# EAGLE design GPRSshield V2 (EAGLE 7.2.0)
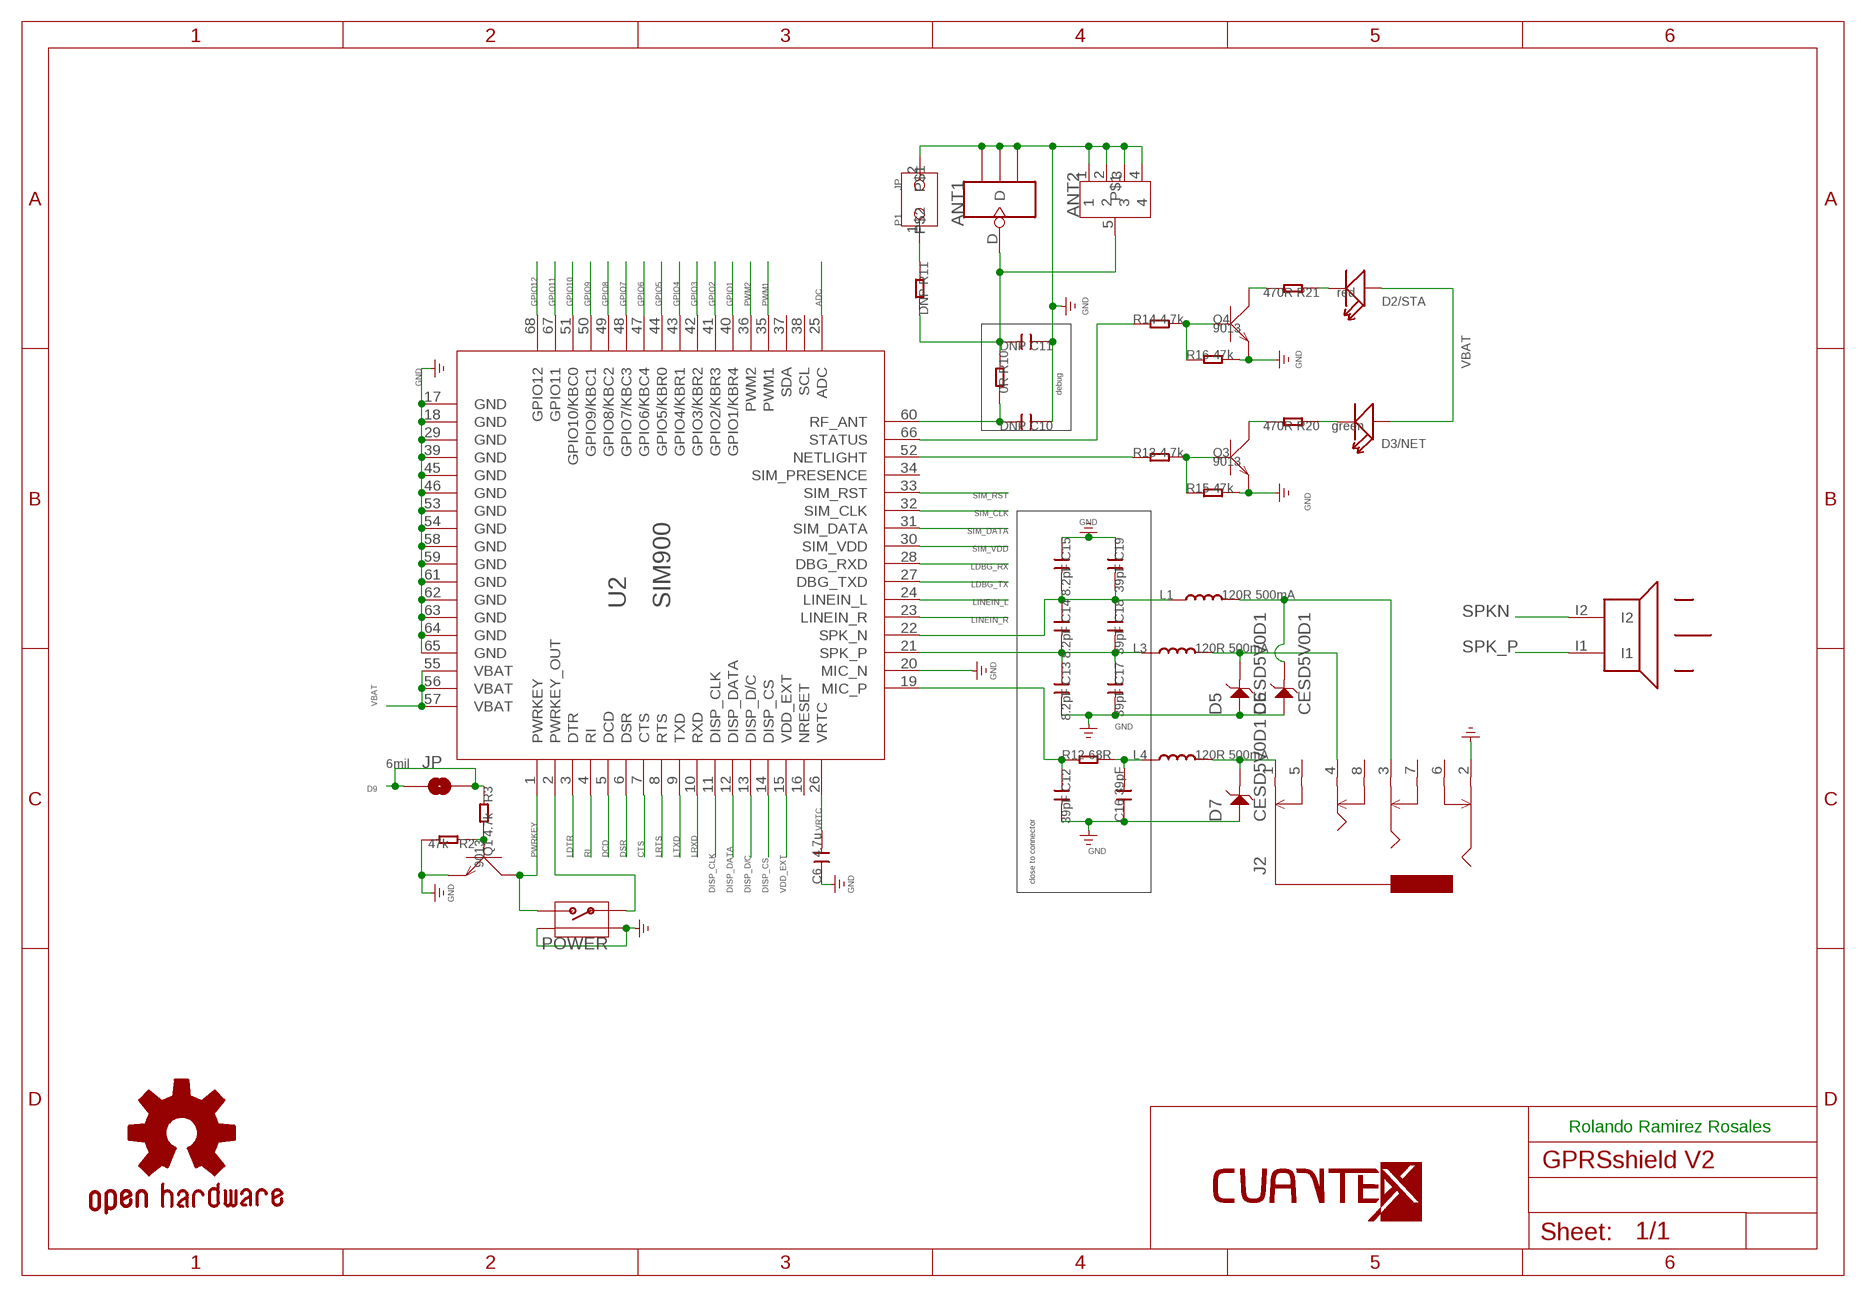
[diagram p0: schematic, sheet 1, part 1 of 2]
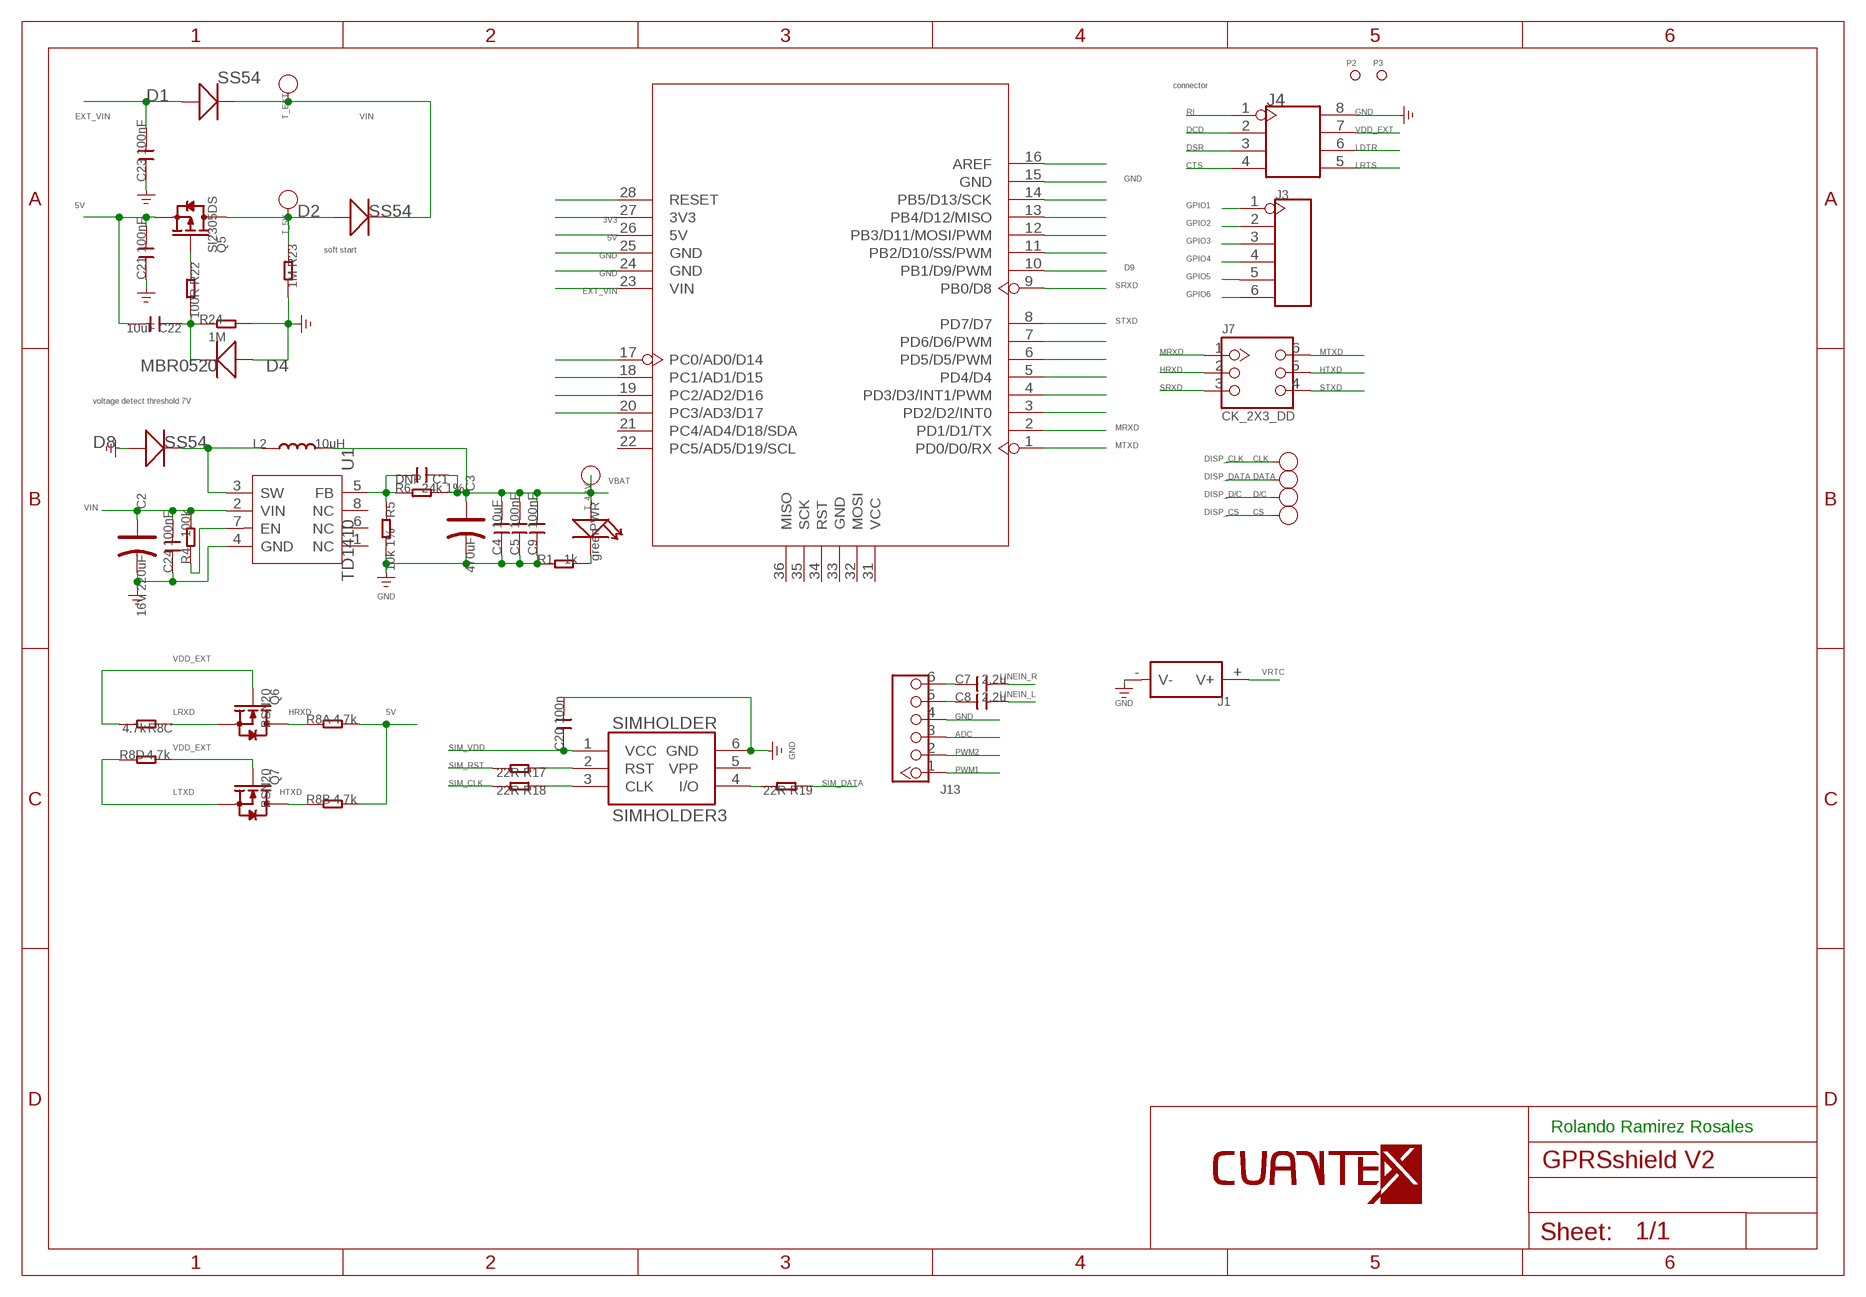
[diagram p1: schematic, sheet 1, part 2 of 2]

## Parts
ANT1  ANTENNA-U-FL  [4P-U-FL]
ANT2  ANTENNA-SMA-IPX  [SMA-TO-IPX]
C1  DNP  C-0603  [C0603]
C2  16V 220uF  CAP-ELECTRO-D  [ELECTRO-SMD-D-5.6MM]
C3  470uF  CAP-AVX-D  [AVX-D]
C4  10uF  C-0805  [C0805]
C5  100nF  C-0603  [C0603]
C6  4.7u  C-0805  [C0805]
C7  2.2u  C-0805  [C0805]
C8  2.2u  C-0805  [C0805]
C9  100nF  C-0603  [C0603]
C10  DNP  C-0603  [C0603]
C11  DNP  C-0603  [C0603]
C12  39pF  C-0603  [C0603]
C13  8.2pF  C-0603  [C0603]
C14  8.2pF  C-0603  [C0603]
C15  8.2pF  C-0603  [C0603]
C16  39pF  C-0603  [C0603]
C17  39pF  C-0603  [C0603]
C18  39pF  C-0603  [C0603]
C19  39pF  C-0603  [C0603]
C20  100n  C-0603  [C0603]
C21  100nF  C-0603  [C0603]
C22  10uF  C-0805  [C0805]
C23  100nF  C-0603  [C0603]
C24  100nF  C-0603  [C0603]
CLK  PAD-TEST-POINT-CIRCLE'4545'  [TP_4545]
CS  PAD-TEST-POINT-CIRCLE'4545'  [TP_4545]
D1  SS54  D'MBRS240LT3'  [SMB]
D2  SS54  D'MBRS240LT3'  [SMB]
D2/STA  red  LED'0603'  [LED-0603]
D3/NET  green  LED'0603'  [LED-0603]
D4  MBR0520  D'MBR0520LT1'  [SOD123-2.7X1.6]
D5  CESD5V0D1  D-ESD  [SOD123-2.7X1.6]
D6  CESD5V0D1  D-ESD  [SOD123-2.7X1.6]
D7  CESD5V0D1  D-ESD  [SOD123-2.7X1.6]
D8  SS54  D'MBRS240LT3'  [SMB]
D/C  PAD-TEST-POINT-CIRCLE'4545'  [TP_4545]
DATA  PAD-TEST-POINT-CIRCLE'4545'  [TP_4545]
GOLD_ORB_SM1  OSHWLOGO_GOLD_ORB_SM  [OSHW2]
J1  HOLDER-BAT  [SMD-CR1220-2]
J2  AUDIO-8P'PJ-3536-L6S'  [8P-3.5-SMD]
J3  HEADER-6P-65/35MIL  [6P-2.54-65/35MIL]
J4  HEADER-2X4P-2.54  [2X4P-2.54]
J7  CK_2X3_DD  [CK_2X3]
J13  HEADER_1X6  [CK_1X6]
JP  PAD-SOLDERJUMPERNC  [2P-SMD-3.3X2]
L1  120R 500mA  L'0603'  [L0603]
L2  10uH  L'0630'  [L0630]
L3  120R 500mA  L'0603'  [L0603]
L4  120R 500mA  L'0603'  [L0603]
P1  JP  [JP]
P2  PAD-MARK  [ROUND-MARK-1.0]
P3  PAD-MARK  [ROUND-MARK-1.0]
POWER  BUTTON-4P-REINFORCE'TS-118E'  [4P-SMD-7X3.5X3.5H]
PWR  green  007-LED0603  [D0603]
Q1  9013  TRANSISTOR-NPN-SOT23  [SOT23]
Q3  9013  TRANSISTOR-NPN-SOT23  [SOT23]
Q4  9013  TRANSISTOR-NPN-SOT23  [SOT23]
Q5  SI2305DS  MOSFET-P'SI2323CDS/SI2305DS<BR>'  [SOT23]
Q6  BSN20  MOSFET-N'SOT23'  [SOT23]
Q7  BSN20  MOSFET-N'SOT23'  [SOT23]
R1  1k  R-0603  [R0603]
R2  47k  R-0603  [R0603]
R3  4.7k  R-0603  [R0603]
R4  100k  R-0603  [R0603]
R5  10k 1%  R-0603  [R0603]
R6  24k 1%  R-0603  [R0603]
R8  4.7k  R-4R-1206  [1206-8-3.3X2.4]
R10  0R  R-0603  [R0603]
R11  DNP  R-0603  [R0603]
R12  68R  R-0603  [R0603]
R13  4.7k  R-0603  [R0603]
R14  4.7k  R-0603  [R0603]
R15  47k  R-0603  [R0603]
R16  47k  R-0603  [R0603]
R17  22R  R-0603  [R0603]
R18  22R  R-0603  [R0603]
R19  22R  R-0603  [R0603]
R20  470R  R-0603  [R0603]
R21  470R  R-0603  [R0603]
R22  100R  R-0603  [R0603]
R23  1M  R-0603  [R0603]
R24  1M  R-0603  [R0603]
SIMHOLDER  SIMHOLDER3  [SIMHOLDER3]
T_4.1V  PAD-TEST-POINT-CIRCLE'4545'  [TP_4545]
T_5V  PAD-TEST-POINT-CIRCLE'4545'  [TP_4545]
T_EXT  PAD-TEST-POINT-CIRCLE'4545'  [TP_4545]
U1  TD1410  [SOP8]
U2  SIM900  [SIM900]
U3  ARDUINO'W/O-SILK'  [ARDUINO-W/O-SILK]
U$4  SPEAKER_HETPRO  [SPK_SMD]
U$11  LOGO-TOP-10MM  [C-000]
U$23  LOGO-TOP-30MM  [C-1]

## Nets
3V3: U3.27(3V3)
5V: C21.2 C22.2 Q5.2(S) R8.7 R8.8 U3.26(5V)
ADC: J13.3 U2.25(ADC)
CTS: J4.4 U2.7(CTS)
D9: JP.1 JP.2 R3.1 U3.10(PB1/D9/PWM)
DCD: J4.2 U2.5(DCD)
DISP_CLK: CLK.T U2.11(DISP_CLK)
DISP_CS: CS.T U2.14(DISP_CS)
DISP_D/C: D/C.T U2.13(DISP_D/C)
DISP_DATA: DATA.T U2.12(DISP_DATA)
DSR: J4.3 U2.6(DSR)
EXT_VIN: C23.2 D1.+ U3.23(VIN)
GND: ANT1.GND1 ANT1.GND2 ANT1.GND3 ANT2.1 ANT2.2 ANT2.3 ANT2.4 C2.- C3.- C4.1 C5.1 C6.1 C9.1 C10.1 C11.1 C12.2 C13.2 C15.1 C16.1 C17.2 C19.1 C20.2 C21.1 C23.1 C24.1 D4.1(+) D5.1 D6.1 D7.1 D8.+ J1.-(V-) J2.2 J4.8 J13.4 P1.2 POWER.S1 POWER.S2 Q1.2(E) Q3.2(E) Q4.2(E) R1.1 R2.2 R5.2 R15.2 R16.2 R23.2 R24.2 SIMHOLDER.6(GND) U1.4(GND) U2.17(GND) U2.18(GND) U2.20(MIC_N) U2.29(GND) U2.39(GND) U2.45(GND) U2.46(GND) U2.53(GND) U2.54(GND) U2.58(GND) U2.59(GND) U2.61(GND) U2.62(GND) U2.63(GND) U2.64(GND) U2.65(GND) U3.15(GND) U3.24(GND) U3.25(GND)
GPIO1: J3.1 U2.40(GPIO1/KBR4)
GPIO2: J3.2 U2.41(GPIO2/KBR3)
GPIO3: J3.3 U2.42(GPIO3/KBR2)
GPIO4: J3.4 U2.43(GPIO4/KBR1)
GPIO5: J3.5 U2.44(GPIO5/KBR0)
GPIO6: J3.6 U2.47(GPIO6/KBC4)
GPIO7: U2.48(GPIO7/KBC3)
GPIO8: U2.49(GPIO8/KBC2)
GPIO9: U2.50(GPIO9/KBC1)
GPIO10: U2.51(GPIO10/KBC0)
GPIO11: U2.67(GPIO11)
GPIO12: U2.68(GPIO12)
HRXD: J7.2 Q6.3(D) R8.1
HTXD: J7.5 Q7.3(D) R8.2
LDBG_RX: U2.28(DBG_RXD)
LDBG_TX: U2.27(DBG_TXD)
LDTR: J4.6 U2.3(DTR)
LINEIN_L: C8.2 U2.24(LINEIN_L)
LINEIN_R: C7.2 U2.23(LINEIN_R)
LRTS: J4.5 U2.8(RTS)
LRXD: Q6.2(S) R8.3 U2.10(RXD)
LTXD: Q7.2(S) R8.4 U2.9(TXD)
MRXD: J7.1 U3.2(PD1/D1/TX)
MTXD: J7.6 U3.1(PD0/D0/RX)
N$1: C10.2 R10.2 U2.60(RF_ANT)
N$3: Q3.3(C) R20.2
N$4: R19.2 SIMHOLDER.4(I/O)
N$5: R18.1 SIMHOLDER.3(CLK)
N$6: R17.1 SIMHOLDER.2(RST)
N$7: D3/NET.- R20.1
N$8: Q3.1(B) R13.2 R15.1
N$9: PWR.- R1.2
N$10: R13.1 U2.52(NETLIGHT)
N$11: POWER.1 U2.2(PWRKEY_OUT)
N$12: R4.1 U1.7(EN)
N$13: C12.1 R12.1 U2.19(MIC_P)
N$15: C13.1 C14.2 C17.1 C18.2 L3.1 U2.21(SPK_P)
N$16: Q4.3(C) R21.2
N$17: D2/STA.- R21.1
N$18: Q4.1(B) R14.2 R16.1
N$19: C14.1 C15.2 C18.1 C19.2 L1.1 U2.22(SPK_N)
N$20: R14.1 U2.66(STATUS)
N$21: ANT1.D ANT2.5 C11.2 R10.1 R11.2
N$23: C7.1 J13.6
N$24: U3.3(PD2/D2/INT0)
N$25: U3.4(PD3/D3/INT1/PWM)
N$26: U3.5(PD4/D4)
N$27: U3.6(PD5/D5/PWM)
N$28: U3.7(PD6/D6/PWM)
N$29: C8.1 J13.5
N$30: C16.2 L4.1 R12.2
N$31: Q5.1(G) R22.1
N$32: U3.11(PB2/D10/SS/PWM)
N$33: U3.12(PB3/D11/MOSI/PWM)
N$34: U3.13(PB4/D12/MISO)
N$35: U3.14(PB5/D13/SCK)
N$36: Q1.1(B) R2.1 R3.2
N$37: U3.16(AREF)
N$39: C22.1 D4.2(-) R22.2 R24.1
N$41: U3.20(PC3/AD3/D17)
N$42: U3.19(PC2/AD2/D16)
N$43: U3.18(PC1/AD1/D15)
N$44: U3.17(PC0/AD0/D14)
N$45: D7.2 J2.1 L4.2
N$47: C1.2 R5.1 R6.1 U1.5(FB)
N$50: U3.28(RESET)
N$52: P1.1 R11.1
PU2: D8.- L2.1 U1.3(SW)
PWM1: J13.1 U2.35(PWM1)
PWM2: J13.2 U2.36(PWM2)
PWRKEY: POWER.2 Q1.3(C) U2.1(PWRKEY)
RI: J4.1 U2.4(RI)
SIM_CLK: R18.2 U2.32(SIM_CLK)
SIM_DATA: R19.1 U2.31(SIM_DATA)
SIM_RST: R17.2 U2.33(SIM_RST)
SIM_VDD: C20.1 SIMHOLDER.1(VCC) U2.30(SIM_VDD)
SPK_P: D5.2 J2.4 L3.2 U$4.I1
SPKN: D6.2 J2.3 L1.2 U$4.I2
SRXD: J7.3 U3.9(PB0/D8)
STXD: J7.4 U3.8(PD7/D7)
TRP1: D2.+ Q5.3(D) R23.1 T_5V.T
VBAT: C1.1 C3.+ C4.2 C5.2 C9.2 D2/STA.+ D3/NET.+ L2.2 PWR.+ R6.2 T_4.1V.T U2.55(VBAT) U2.56(VBAT) U2.57(VBAT)
VDD_EXT: J4.7 Q6.1(G) Q7.1(G) R8.5 R8.6 U2.15(VDD_EXT)
VIN: C2.+ C24.2 D1.- D2.- R4.2 T_EXT.T U1.2(VIN)
VRTC: C6.2 J1.+(V+) U2.26(VRTC)
Unconnected: J2.5 J2.6 J2.7 J2.8 SIMHOLDER.5(VPP) U1.1(NC) U1.6(NC) U1.8(NC) U2.16(NRESET) U2.34(SIM_PRESENCE) U2.37(SDA) U2.38(SCL) U3.21(PC4/AD4/D18/SDA) U3.22(PC5/AD5/D19/SCL) U3.31(VCC) U3.32(MOSI) U3.33(GND) U3.34(RST) U3.35(SCK) U3.36(MISO)

## Notes on the sheet
- connector
- soft start
- debug
- voltage detect threshold 7V
- 6mil
- close to connector
- Rolando Ramirez Rosales | Rolando Ramirez Rosales

## Library data of the parts
ANT1 = Connector:ANTENNA-U-FL
ANT2 = Elecrow_test:ANTENNA-SMA-IPX
C1 C4-C24 = Discrete:C*: Ceramic Capacitors
C2 C3 = Discrete:CAP*: Electrolytic Capacitors,Tantalum Capacitors and Super Capacitors
CLK CS D/C DATA T_4.1V T_5V T_EXT = Discrete:PAD-TEST-POINT-CIRCLE; PARTNO: DNP
D1 D2 D4 D8 = Discrete:D*
D2/STA D3/NET = Discrete:LED*
D5-D7 = template:D-ESD: Diodes for Protectiong against ESD
GOLD_ORB_SM1 = OPENHW:OSHWLOGO: These are Open-Source Hardware logos.
J1 = Connector:HOLDER-BAT: button cell holder
J2 = template:AUDIO-8P
J3 = Connector:HEADER-6P
J4 = Connector:HEADER-2X4P
J7 = CONNECTER:CK_2X3
J13 = CONNECTER:HEADER_1X6
JP = Discrete:PAD-SOLDERJUMPER: Solder Jumper Standard SMD solder jumper. Used to automate production. Two varients : Normally Open and Normally Closed are the same, but have different paste layers. NC will have a large amount of paste and should jumper during reflow.
L1-L4 = Discrete:L*
P1 = mySeeed:JP
P2 P3 = Discrete:PAD-MARK; PARTNO: DNP
POWER = Discrete:BUTTON-4P-REINFORCE: TS-1188E http://www.best-dz.com/?thread-374-2.html
PWR = Discrete:007-LED*
Q1 Q3 Q4 = Discrete:TRANSISTOR-NPN*: NPN audion
Q5 = Discrete:MOSFET-P
Q6 Q7 = Discrete:MOSFET-N: IRLL014: http://www.vishay.com/docs/91319/sihll014.pdf
R1-R6 R10-R24 = Discrete:R*
R8 = Discrete:R-4R*: Resistor Array
SIMHOLDER = SparkFun2:SIMHOLDER3
U1 = template:TD1410: 2A 380KHz 20V PWM Buck DC/DC Converter
U2 = ICs_v54:SIM900
U3 = moudle:ARDUINO
U$4 = Speaker_HeTPro:SPEAKER_HETPRO
U$11 = LOGOTIPOS:LOGO-TOP-10MM
U$23 = LOGOTIPOS:LOGO-TOP-30MM

## Net classes
0 default: clearance 0.152 mm

## Board
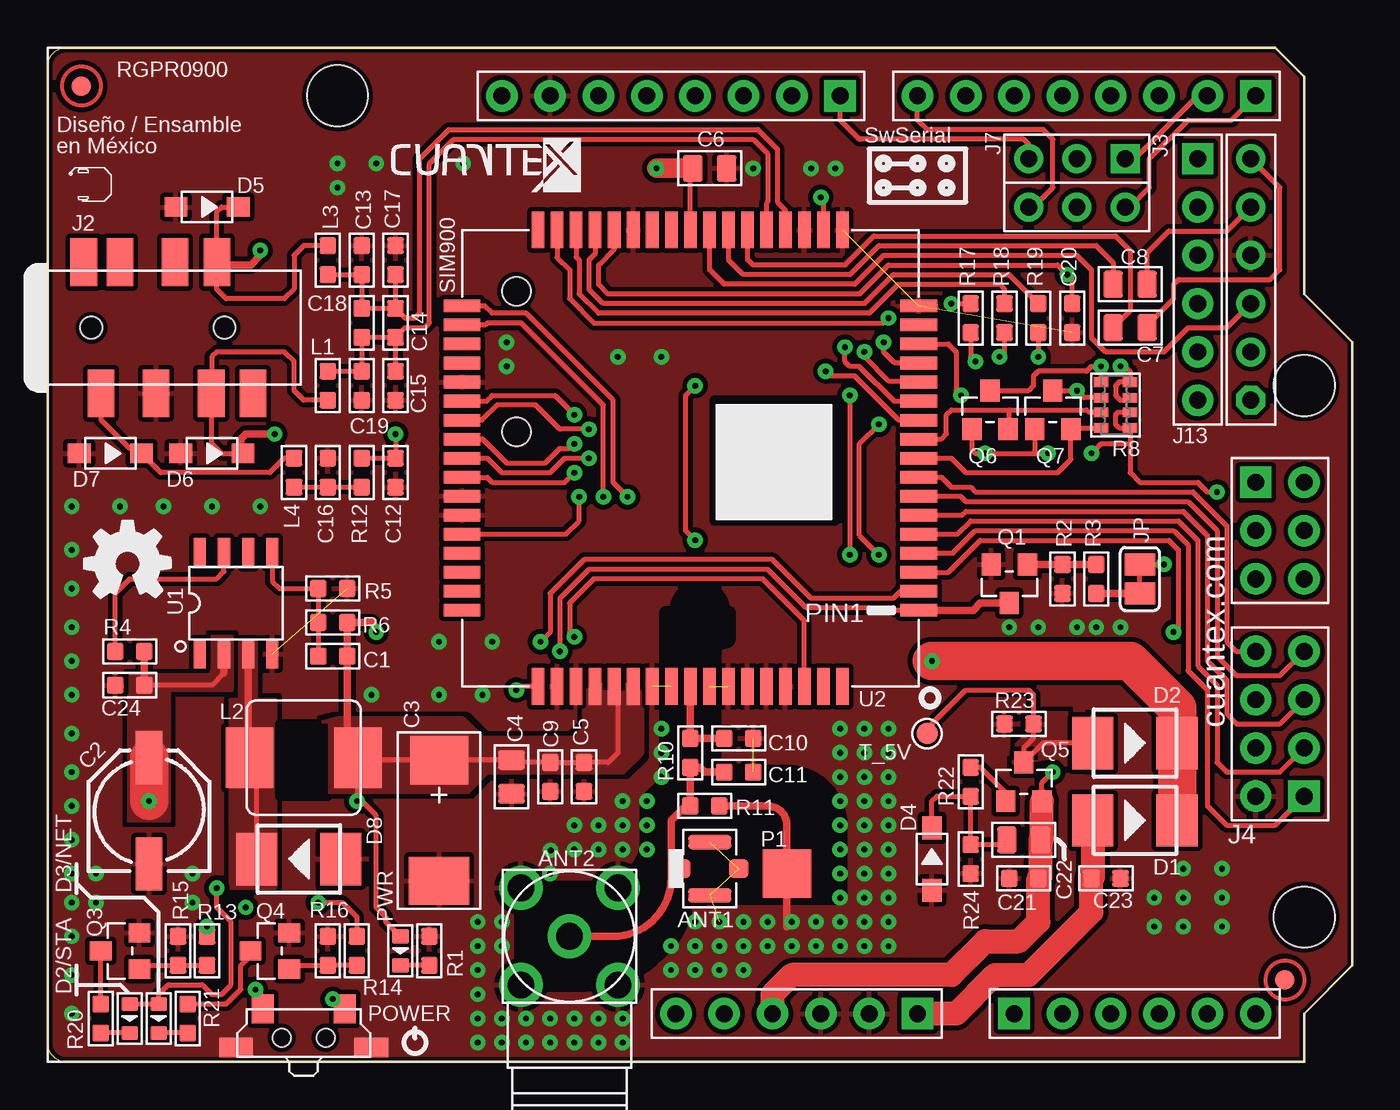
[diagram p2: board, top side]
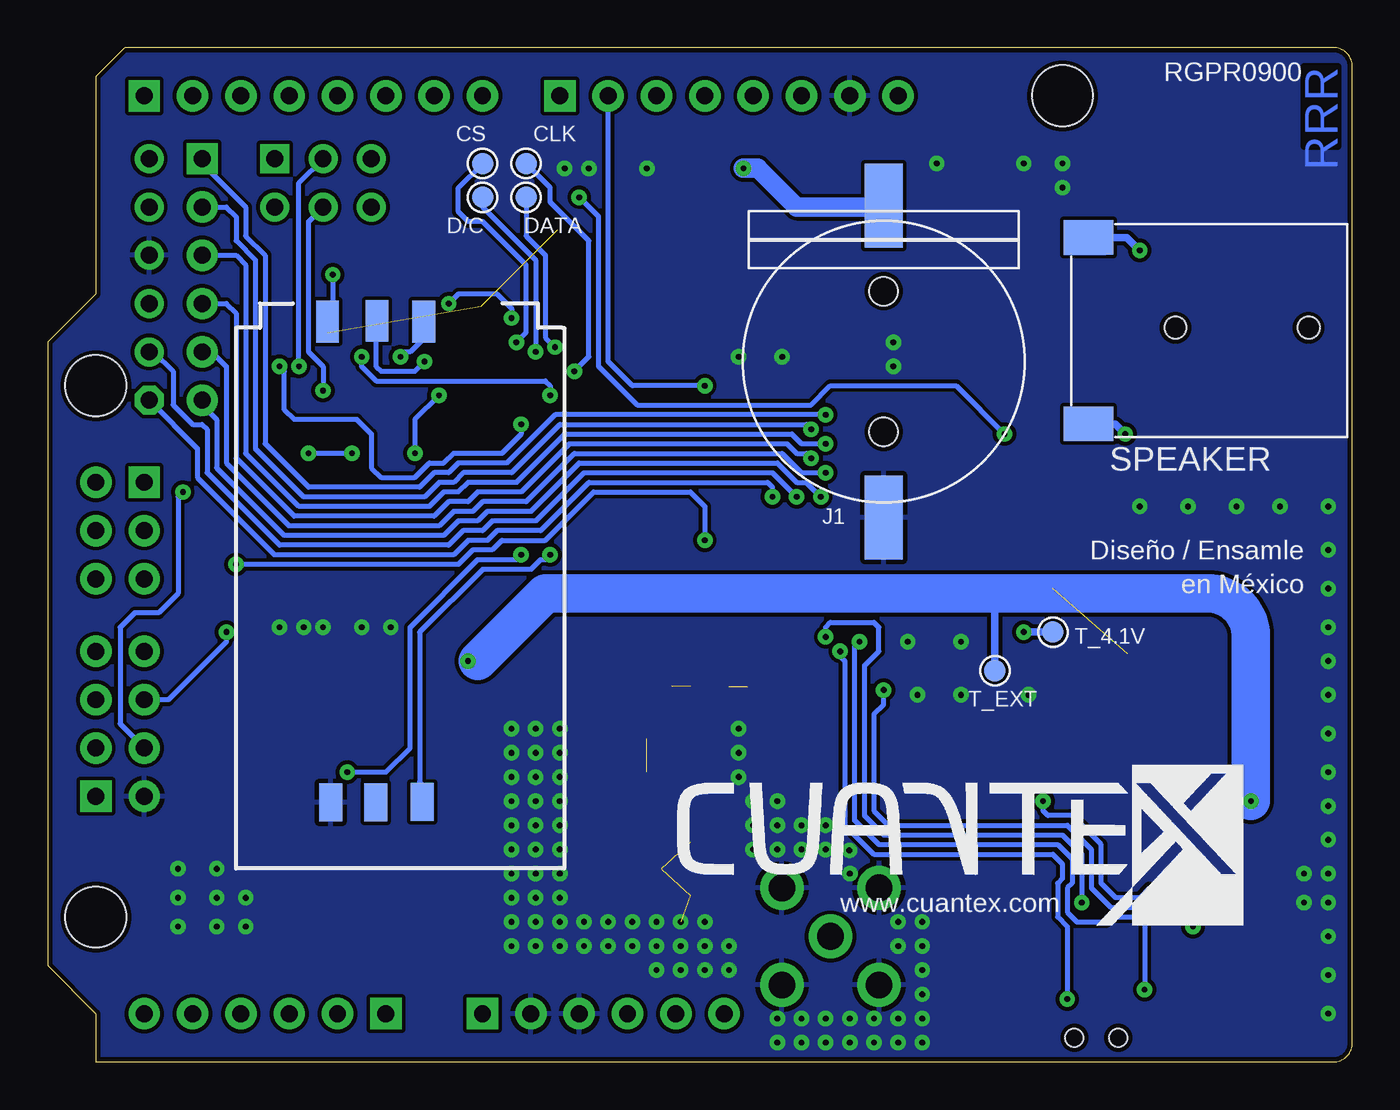
[diagram p3: board, bottom side, seen from below]

Size 68.58 x 53.34 mm. Coordinates in mm from the lower left corner, seen from the top.
Outline: 0,1.02 0,52.32 arc-90 1.02,53.34 64.52,53.34 66.04,51.82 66.04,40.39 68.58,37.85 68.58,5.08 66.04,2.54 66.04,0 1.02,0 arc-90 0,1.02
Copper layers (1*16): Top 0.035mm / dielectric 1.5mm / Bottom 0.035mm
Design rules "cuantex2layerdrc": minimum track width 8mil, minimum drill 0.3mm, track to track 8mil, track to pad 8mil, pad to pad 8mil, via to via 8mil, smd to smd 0mil, copper to edge 10mil, drill to drill 10mil, minimum pad ring 10mil, minimum via ring 10mil, stop-mask expansion 4mil, vias tented up to drill 0mil, thermal gap 10mil
tRestrict: area 24.9,4.1 to 41.7,23.6; area 35.1,28.4 to 41.4,34.8; area 27.2,19.6 to 27.4,20.1; area 29.2,19.6 to 29.5,20.1; area 30.1,19.5 to 30.3,20; area 36.2,19.5 to 36.4,20; area 37.2,19.5 to 37.4,20; area 38.2,19.5 to 38.4,20; area 21.5,29.1 to 22,29.4; area 12.2,14 to 14.7,17.8

### Footprints (pad centres in the part's own frame; a part is rotated, then mirrored left to right if it is on the bottom)
4P-U-FL = smd 1.016 x 1.016: D -1.524,0; GND3 1.524,0 | smd 2.286 x 0.762: GND1 0,1.397; GND2 0,-1.397
SMA-TO-IPX = drill 1.4 pad 2.3: 1 -2.55,2.55; 2 2.55,2.55; 3 2.55,-2.55; 4 -2.55,-2.55; 5 0,0
C0603 = smd 0.889 x 0.889: 1 -0.762,0; 2 0.762,0
ELECTRO-SMD-D-5.6MM = smd 2.794 x 1.397: + 2.794,0; - -2.794,0
AVX-D = smd 2.54 x 3.048: + -3.175,0 | smd 2.54 x 3.175: - 3.175,0
C0805 = smd 1.016 x 1.397: 1 -0.889,0; 2 0.889,0
TP_4545 = smd 1.143 x 1.143: T 0,0
SMB = smd 2.159 x 2.743: + -2.21,0; - 2.21,0
LED-0603 = smd 0.762 x 0.889: + -0.762,0; - 0.762,0
SOD123-2.7X1.6 = smd 1.2 x 1.02: 1 -1.635,0; 2 1.635,0
SMD-CR1220-2 = smd 2 x 4.4: + 0,-8.2; - 0,8.2 | hole 1.5: 0,3.7; 0,-3.7
8P-3.5-SMD = smd 1.4 x 2.5: 1 2.8,-3.45; 2 5.7,-3.45; 3 8.6,-3.45; 4 8.9,3.45; 5 1.9,3.45; 6 3.8,3.45; 7 6.7,3.45; 8 10.8,-3.45 | hole 1.149: 2.3,0; 9.3,0
6P-2.54-65/35MIL = drill 0.889 pad 1.651 square: 1 0,6.35 | drill 0.889 pad 1.651: 2 0,3.81; 3 0,1.27; 4 0,-1.27; 5 0,-3.81; 6 0,-6.35
2X4P-2.54 = drill 0.889 pad 1.651 square: 1 -1.27,3.81 | drill 0.889 pad 1.651: 2 -1.27,1.27; 3 -1.27,-1.27; 4 -1.27,-3.81; 5 1.27,-3.81; 6 1.27,-1.27; 7 1.27,1.27; 8 1.27,3.81
CK_2X3 = drill 0.889 pad 1.524 square: 1 -1.27,2.54 | drill 0.889 pad 1.524: 2 -1.27,0; 3 -1.27,-2.54; 4 1.27,-2.54; 5 1.27,0; 6 1.27,2.54
CK_1X6 = drill 0.889 pad 1.524 octagon: 1 0,6.35 | drill 0.889 pad 1.524: 2 0,3.81; 3 0,1.27; 4 0,-1.27; 5 0,-3.81; 6 0,-6.35
2P-SMD-3.3X2 = smd 1.168 x 1.6: 1 -0.762,0; 2 0.762,0
L0603 = smd 0.889 x 0.889: 1 -0.762,0; 2 0.762,0
L0630 = smd 2.5 x 3.2: 1 -2.85,0; 2 2.85,0
JP = smd 1.27 x 2.54: 1 -0.635,0; 2 0.635,0
ROUND-MARK-1.0 = smd 1.016 x 1.016: P$1 0,0
4P-SMD-7X3.5X3.5H = smd 1.143 x 1.524: 1 -2.159,1.524; 2 2.159,1.524 | smd 1.778 x 1.016: S1 -3.556,-0.508; S2 3.556,-0.508 | hole 0.95: -1.15,0; 1.15,0
D0603 = smd 0.762 x 0.889: + -0.762,0; - 0.762,0
SOT23 = smd 1.016 x 1.143: 1 -0.95,-1.016; 2 0.95,-1.016; 3 0,1.016
R0603 = smd 0.889 x 0.889: 1 -0.762,0; 2 0.762,0
1206-8-3.3X2.4 = smd 0.508 x 0.762: 1 -1.206,-0.762; 2 -0.381,-0.762; 3 0.381,-0.762; 4 1.206,-0.762; 5 1.206,0.762; 6 0.381,0.762; 7 -0.381,0.762; 8 -1.206,0.762
SIMHOLDER3 = smd 2.2 x 1.2: 1 0.95,4.81; 2 0.91,7.41; 3 0.95,9.86 | smd 2 x 1.2: 4 26.2,9.78; 5 26.22,7.34; 6 26.22,4.98
SOP8 = smd 0.635 x 1.524: 1 -1.905,-2.667; 2 -0.635,-2.667; 3 0.635,-2.667; 4 1.905,-2.667; 5 1.905,2.667; 6 0.635,2.667; 7 -0.635,2.667; 8 -1.905,2.667
SIM900 = smd 1.93 x 0.66: 1 -12,8; 2 -12,7; 3 -12,6; 4 -12,5; 5 -12,4; 6 -12,3; 7 -12,2; 8 -12,1; 9 -12,0; 10 -12,-1; 11 -12,-2; 12 -12,-3; 13 -12,-4; 14 -12,-5; 15 -12,-6; 16 -12,-7; 17 -12,-8; 35 12,-8; 36 12,-7; 37 12,-6; 38 12,-5; 39 12,-4; 40 12,-3; 41 12,-2; 42 12,-1; 43 12,0; 44 12,1; 45 12,2; 46 12,3; 47 12,4; 48 12,5; 49 12,6; 50 12,7; 51 12,8 | smd 0.66 x 1.93: 18 -8,-12; 19 -7,-12; 20 -6,-12; 21 -5,-12; 22 -4,-12; 23 -3,-12; 24 -2,-12; 25 -1,-12; 26 0,-12; 27 1,-12; 28 2,-12; 29 3,-12; 30 4,-12; 31 5,-12; 32 6,-12; 33 7,-12; 34 8,-12; 52 8,12; 53 7,12; 54 6,12; 55 5,12; 56 4,12; 57 3,12; 58 2,12; 59 1,12; 60 0,12; 61 -1,12; 62 -2,12; 63 -3,12; 64 -4,12; 65 -5,12; 66 -6,12; 67 -7,12; 68 -8,12
ARDUINO-W/O-SILK = drill 0.889 pad 1.651 square: 1 63.5,50.8; 9 41.656,50.8; 17 50.8,2.54; 23 45.72,2.54; 36 63.5,30.48 | drill 0.889 pad 1.651: 2 60.96,50.8; 3 58.42,50.8; 4 55.88,50.8; 5 53.34,50.8; 6 50.8,50.8; 7 48.26,50.8; 8 45.72,50.8; 10 39.116,50.8; 11 36.576,50.8; 12 34.036,50.8; 13 31.496,50.8; 14 28.956,50.8; 15 26.416,50.8; 16 23.876,50.8; 18 53.34,2.54; 19 55.88,2.54; 20 58.42,2.54; 21 60.96,2.54; 22 63.5,2.54; 24 43.18,2.54; 25 40.64,2.54; 26 38.1,2.54; 27 35.56,2.54; 28 33.02,2.54; 31 66.04,30.48; 32 66.04,27.94; 33 66.04,25.4; 34 63.5,25.4; 35 63.5,27.94 | hole 3.2: 15.24,50.8; 66.04,35.56; 66.04,7.62
SPK_SMD = smd 2.6 x 1.8: I1 -6,5; I2 -6,-4.8

### Placement (x,y rotation side)
ANT1  34.8,10.16 0 top
ANT2  27.43,6.6 0 top
C1  14.99,21.34 180 top
C2  5.33,13.21 90 top
C3  20.57,12.7 270 top
C4  24.38,14.99 90 top
C5  28.19,14.99 90 top
C6  34.8,46.99 180 top
C7  56.9,38.61 180 top
C8  56.9,40.89 180 top
C9  26.42,14.99 90 top
C10  36.32,17.02 180 top
C11  36.32,15.24 180 top
C12  18.29,30.99 270 top
C13  16.51,42.16 90 top
C14  18.29,38.86 90 top
C15  18.29,35.56 90 top
C16  14.73,30.99 270 top
C17  18.29,42.16 90 top
C18  16.51,38.86 90 top
C19  16.51,35.56 90 top
C20  53.85,39.12 270 top
C21  51.31,9.65 0 top
C22  51.31,11.68 0 top
C23  55.63,9.65 180 top
C24  4.32,19.81 0 top
CLK  43.43,47.24 0 bottom
CS  45.72,47.24 0 bottom
D1  57.15,12.7 0 top
D2  57.15,16.76 0 top
D2/STA  5.84,2.29 270 top
D3/NET  4.32,2.29 270 top
D4  46.48,10.67 90 top
D5  8.38,44.96 0 top
D6  8.64,32 0 top
D7  3.3,32 0 top
D8  13.21,10.67 180 top
D/C  45.72,45.47 0 bottom
DATA  43.43,45.47 0 bottom
GOLD_ORB_SM1  0.38,21.92 0 top
J1  24.64,36.83 180 bottom
J2  0,38.61 0 top
J3  60.45,41.15 0 top
J4  64.77,17.78 180 top
J7  54.1,46.23 270 top
J13  63.25,41.15 180 top
JP  57.4,25.4 270 top
L1  14.73,35.56 270 top
L2  13.46,16 0 top
L3  14.73,42.16 90 top
L4  12.95,30.99 90 top
P1  38.86,9.91 270 top
P2  65.02,4.32 0 top
P3  1.78,51.31 0 top
POWER  13.46,1.27 0 top
PWR  18.54,5.84 270 top
Q1  50.55,25.15 180 top
Q3  3.81,5.84 90 top
Q4  11.68,5.84 90 top
Q5  51.31,14.73 0 top
Q6  49.53,34.29 0 top
Q7  52.83,34.29 0 top
R1  20.07,5.84 270 top
R2  53.34,25.4 270 top
R3  55.12,25.4 90 top
R4  4.32,21.59 0 top
R5  14.99,24.89 0 top
R6  14.99,23.11 0 top
R8  56.13,34.54 270 top
R10  33.78,16.26 90 top
R11  34.54,13.46 180 top
R12  16.51,30.99 270 top
R13  8.38,5.84 270 top
R14  16.26,5.84 270 top
R15  6.86,5.84 90 top
R16  14.73,5.84 90 top
R17  48.51,39.12 90 top
R18  50.29,39.12 90 top
R19  52.07,39.12 270 top
R20  2.79,2.29 90 top
R21  7.37,2.29 90 top
R22  48.51,14.73 270 top
R23  51.05,17.78 180 top
R24  48.51,10.67 270 top
SIMHOLDER  58.67,39.88 270 bottom
T_4.1V  15.75,22.61 0 bottom
T_5V  46.23,17.27 0 top
T_EXT  18.8,20.57 0 bottom
U1  9.91,24.13 0 top
U2  33.78,31.75 180 top
U3  0,0 0 top
U$4  7.87,38.35 0 bottom
U$11  18.03,45.72 0 top
U$23  35.56,7.11 0 bottom

### Tracks (layer width: path | path; a pad name or v marks a point on that pad's centre or on a via)
5V  (via drill 0.3)
  Top 0.254: 52.26,11.74 C22.2 | 52.2,9.78 C21.2 | R8.7 56.77,34.8 56.39,34.8 56.13,35.05 56.13,35.56 56.33,35.75 R8.8 56.9,36.32 56.64,36.58 v56.39,36.58 | Q5.2 52.26,14.67 v52.83,15.24 | v43.69,33.53 42.67,32.51 42.67,27.69 v43.69,26.67
  Top 1.27: U3.26 38.1,3.56 39.12,4.57 47.5,4.57 49.28,6.35 51.05,6.35 52.07,7.37 C21.2 | 52.2,9.78 C22.2 | 52.26,11.74 Q5.2
  Bottom 0.254: v52.83,15.24 50.8,15.24 49.53,16.51 49.53,22.86 45.97,26.42 43.94,26.42 v43.69,26.67 | v43.69,33.53 43.69,33.02 44.7,32 47.24,32 47.75,31.5 48.51,31.5 49.28,30.73 51.05,30.73 51.56,31.24 51.56,33.02 52.32,33.78 55.63,33.78 56.13,34.29 56.13,36.32 v56.39,36.58
ADC
  Top 0.254: J13.3 61.98,38.61 59.94,38.61 58.67,37.34 55.63,37.34 54.86,38.1 54.86,41.66 54.1,42.42 43.94,42.42 42.42,40.89 35.56,40.89 34.8,41.66 34.8,43.73 U2.25
CTS
  Top 0.254: U2.7 47.97,29.75 48.26,29.46 59.94,29.46 61.47,27.94 61.47,21.34 62.48,20.32 64.77,20.32 J4.4
D9  (via drill 0.3)
  Top 0.254: v58.67,26.16 JP.1 JP.2 | v34.04,27.43 33.53,27.94 33.53,35.05 v34.04,35.56
  Top 0.406: JP.2 R3.1
  Bottom 0.254: v34.04,35.56 37.85,35.56 39.12,36.83 U3.10 | v58.67,26.16 46.99,26.16 46.23,26.92 45.21,26.92 44.7,27.43 42.42,27.43 39.88,29.97 34.8,29.97 34.04,29.21 v34.04,27.43
DCD
  Top 0.254: U2.5 47.82,27.75 48.51,28.45 59.44,28.45 60.45,27.43 60.45,20.83 61.47,19.81 61.47,15.75 61.98,15.24 64.77,15.24 J4.2
DISP_CLK  (via drill 0.3)
  Top 0.254: U2.11 44.74,33.75 42.42,36.07 41.15,36.07 v40.89,36.32
  Bottom 0.254: CLK.T 42.16,45.97 42.16,45.21 40.13,43.18 40.13,37.08 v40.89,36.32
DISP_CS  (via drill 0.3)
  Top 0.254: U2.14 44.53,36.75 43.94,37.34 v43.94,37.85
  Bottom 0.254: CS.T 46.99,45.97 46.99,44.7 46.48,44.2 45.72,44.2 43.43,41.91 43.43,38.35 v43.94,37.85
DISP_D/C  (via drill 0.3)
  Top 0.254: v42.93,37.34 42.93,37.08 44.2,35.81 45.72,35.81 U2.13
  Bottom 0.254: D/C.T 45.72,44.96 42.93,42.16 v42.93,37.34
DISP_DATA  (via drill 0.3)
  Top 0.254: U2.12 44.5,34.75 42.67,36.58 42.16,36.58 41.91,36.83 v41.91,37.59
  Bottom 0.254: DATA.T 43.43,43.43 42.42,42.42 42.42,38.1 v41.91,37.59
DSR
  Top 0.254: U2.6 48.05,28.75 48.26,28.96 59.69,28.96 60.96,27.69 60.96,21.08 61.98,20.07 61.98,18.29 62.48,17.78 64.77,17.78 J4.3
EXT_VIN
  Top 0.254: 54.94,9.73 C23.2
  Top 1.27: D1.+ 54.94,9.73 | U3.23 47.75,2.54 49.78,4.57 51.56,4.57 54.86,7.87 C23.2
GND  (via drill 0.3)  (9 unrouted)
  Top 0.406: P1.2 38.86,7.11
  other vias: 15.24,45.97 15.24,47.24 17.27,47.24 21.84,47.24 40.13,46.99 41.4,46.99 32.26,37.08 29.97,37.08 11.18,29.21 8.64,29.21 6.1,29.21 3.81,29.21 1.27,29.21 1.27,26.92 1.27,24.89 1.27,22.86 1.27,21.08 1.27,19.3 1.27,17.27 1.27,15.24 1.27,13.46 1.27,11.68 1.27,9.91 2.54,9.91 1.27,8.38 2.54,8.38 1.27,6.6 1.27,4.57 1.27,2.54 7.62,8.38 7.62,9.91 22.86,19.3 20.57,19.3 20.57,22.1 23.37,22.1 32.26,17.53 32.26,16.26 32.26,14.99 31.5,11.18 31.5,13.72 30.23,13.72 30.23,12.45 31.5,12.45 26.44,11.13 30.23,11.18 28.96,11.18 27.69,12.45 27.69,11.18 34.04,6.1 28.96,12.45 32.77,6.1 32.77,4.83 34.04,7.37 35.31,7.37 36.58,7.37 37.85,7.37 39.12,7.37 42.93,7.37 44.2,7.37 41.66,8.64 42.93,8.64 44.2,8.64 44.2,9.91 42.93,9.91 41.66,9.91 41.66,11.18 42.93,11.18 44.2,11.18 44.2,12.45 42.93,12.45 41.66,12.45 41.66,13.72 42.93,13.72 44.2,13.72 44.2,14.99 42.93,14.99 41.66,14.99 41.66,16.26 42.93,16.26 44.2,16.26 44.2,17.53 42.93,17.53 41.66,17.53 50.55,22.86 52.07,22.86 54.1,22.86 55.12,22.86 56.39,22.86 58.17,7.11 58.17,8.64 59.69,7.11 59.69,8.64 59.69,10.16 61.72,10.16 61.72,8.64 61.72,7.11 24.13,36.58 24.13,37.85 37.08,46.99 17.02,19.3 35.31,6.1 26.42,9.91 34.04,4.83 36.58,4.83 22.61,7.37 35.31,4.83 22.61,6.1 23.88,7.37 23.88,6.1 22.61,4.83 22.61,3.56 22.61,2.29 22.61,1.02 23.88,2.29 23.88,1.02 25.15,2.29 25.15,1.02 26.42,2.29 26.42,1.02 27.69,2.29 27.69,1.02 28.96,1.02 28.96,2.29 30.23,2.29 30.23,1.02 41.66,7.37 40.39,7.37 36.58,6.1 37.85,6.1 39.12,6.1 40.39,6.1 41.66,6.1 42.93,6.1 44.2,6.1
  pour Bottom: 66.04,0 66.04,2.54 68.58,5.08 68.58,37.85 66.04,40.39 66.04,51.82 64.52,53.34 0,53.34 0,0
  pour Top (isolate 0.254, rank 6): -1,54 69,54 69,-1 -1,-1
GPIO1  (via drill 0.3)
  Top 0.254: U2.40 23.07,34.75 23.37,35.05 26.67,35.05 v27.69,34.04
  Bottom 0.254: v27.69,34.04 41.91,34.04 44.45,31.5 46.99,31.5 47.5,30.99 48.26,30.99 49.02,30.23 54.86,30.23 57.15,32.51 57.15,42.42 58.17,43.43 58.17,44.96 60.45,47.24 J3.1
GPIO2  (via drill 0.3)
  Top 0.254: v28.45,33.27 26.92,33.27 25.65,34.54 23.62,34.54 22.83,33.75 U2.41
  Bottom 0.254: J3.2 59.18,44.96 58.67,44.45 58.67,43.18 57.66,42.16 57.66,32.26 55.12,29.72 48.77,29.72 48.01,30.48 47.24,30.48 46.74,30.99 44.2,30.99 41.66,33.53 28.7,33.53 v28.45,33.27
GPIO3  (via drill 0.3)
  Top 0.254: U2.42 21.8,32.77 22.86,32.77 24.13,31.5 26.16,31.5 26.92,32.26 27.43,32.26 v27.69,32.51
  Bottom 0.254: J3.3 58.67,42.42 58.17,41.91 58.17,32 55.37,29.21 48.51,29.21 47.75,29.97 46.99,29.97 46.48,30.48 43.94,30.48 41.4,33.02 29.46,33.02 28.96,32.51 v27.69,32.51
GPIO4  (via drill 0.3)
  Top 0.254: v28.45,31.75 27.18,31.75 26.42,30.99 23.88,30.99 23.11,31.75 U2.43
  Bottom 0.254: J3.4 59.18,39.88 58.67,39.37 58.67,31.75 55.63,28.7 48.26,28.7 47.5,29.46 46.48,29.46 45.97,29.97 43.69,29.97 41.15,32.51 29.72,32.51 29.21,32 28.7,32 v28.45,31.75
GPIO5  (via drill 0.3)
  Top 0.254: U2.44 21.8,30.73 23.11,30.73 23.37,30.48 27.18,30.48 v27.69,30.99
  Bottom 0.254: J3.5 59.94,37.34 59.18,36.58 59.18,31.5 55.88,28.19 48.01,28.19 47.24,28.96 46.23,28.96 45.72,29.46 43.43,29.46 40.89,32 29.97,32 28.96,30.99 v27.69,30.99
GPIO6  (via drill 0.3)
  Top 0.254: U2.47 27.24,27.75 27.94,28.45 v27.94,29.72
  Bottom 0.254: J3.6 60.45,34.54 59.69,33.78 59.69,31.24 56.13,27.69 47.75,27.69 46.99,28.45 45.97,28.45 45.47,28.96 43.18,28.96 40.64,31.5 30.23,31.5 29.21,30.48 28.7,30.48 v27.94,29.72
HRXD  (via drill 0.3)
  Top 0.254: Q6.3 51.56,35.31 51.82,35.56 51.82,36.07 52.07,36.32 54.61,36.32 54.86,36.58 v55.37,36.58 R8.1
  Bottom 0.254: v55.37,36.58 55.37,46.23 J7.2
HTXD  (via drill 0.3)
  Top 0.254: Q7.3 v54.1,35.31 54.48,34.92 R8.2
  Bottom 0.254: J7.5 54.86,44.2 54.86,37.34 54.1,36.58 v54.1,35.31
LDTR  (via drill 0.3)
  Top 0.254: U2.3 47.34,25.75 49.02,27.43 58.93,27.43 59.44,26.92 59.44,22.86 v59.18,22.61
  Bottom 0.254: v59.18,22.61 59.18,22.1 62.23,19.05 J4.6
LINEIN_L
  Top 0.254: U2.24 35.78,42.2 36.58,41.4 42.16,41.4 43.69,42.93 55.12,42.93 56.01,42.04 C8.2
LINEIN_R
  Top 0.254: U2.23 36.78,42.21 37.08,41.91 41.91,41.91 43.43,43.43 56.13,43.43 56.9,42.67 56.9,39.5 C7.2
LRTS
  Top 0.254: U2.8 46.97,30.75 47.5,30.23 48.51,30.23 48.77,29.97 60.2,29.97 61.98,28.19 61.98,22.1 62.48,21.59 J4.5
LRXD
  Top 0.254: U2.10 45.8,32.77 46.99,32.77 47.24,33.02 47.24,34.04 47.5,34.29 50.55,34.29 | 50.55,34.29 54.61,34.29 54.74,34.16 R8.3 | Q6.2 50.55,33.34 50.55,34.29
LTXD
  Top 0.254: R8.4 53.85,33.34 Q7.2 53.78,31.68 53.09,30.99 48.26,30.99 47.5,31.75 U2.9
MRXD
  Top 0.254: J7.1 57.15,47.5 60.45,50.8 U3.2
MTXD
  Top 0.254: J7.6 56.9,44.96 57.91,45.97 57.91,47.5 59.94,49.53 62.23,49.53 U3.1
N$1
  Top 0.406: U2.60 R10.2 C10.2
N$3
  Top 0.254: R20.2 Q3.3
N$4  (via drill 0.3)
  Top 0.254: R19.2 v52.07,37.08 | v42.16,35.05 v42.16,26.67
  Bottom 0.254: SIMHOLDER.4 48.77,13.8 48.77,14.48 49.02,14.73 49.02,22.61 45.72,25.91 43.18,25.91 42.67,26.42 42.42,26.42 v42.16,26.67 | v42.16,35.05 42.16,35.56 42.42,35.81 51.31,35.81 52.07,36.58 v52.07,37.08
N$5  (via drill 0.3)
  Top 0.254: R18.1 50.29,37.34 v50.04,37.08
  Bottom 0.254: SIMHOLDER.3 48.77,38.88 48.77,38.1 49.53,37.34 49.78,37.34 v50.04,37.08
N$6  (via drill 0.3)
  Top 0.254: R17.1 48.51,37.08 v48.77,36.83
  Bottom 0.254: SIMHOLDER.2 51.31,38.92 51.31,36.58 51.05,36.32 49.28,36.32 v48.77,36.83
N$7
  Top 0.254: D3/NET.- R20.1
N$8
  Top 0.254: Q3.1 5.01,5.08 R15.1 R13.2
N$9
  Top 0.254: R1.2 PWR.-
N$10  (via drill 0.3)
  Top 0.254: U2.52 24.83,19.75 v24.64,19.56 | R13.1 v8.38,7.11
  Bottom 0.254: v24.64,19.56 24.64,18.8 25.15,18.29 25.15,13.21 24.38,12.45 14.99,12.45 13.72,11.18 13.72,9.14 12.7,8.13 v10.41,8.13 9.4,8.13 v8.38,7.11
N$11  (via drill 0.3)
  Top 0.254: U2.2 44.82,24.75 44.45,24.38 40.13,24.38 38.1,26.42 28.19,26.42 26.42,24.64 26.42,22.61 v25.91,22.1 | v10.92,3.81 11.3,3.43 POWER.1
  Bottom 0.254: v25.91,22.1 26.16,21.84 26.16,12.7 24.89,11.43 15.49,11.43 14.73,10.67 14.73,9.4 14.99,9.14 14.99,7.87 14.48,7.37 12.95,7.37 12.7,7.62 11.18,7.62 10.92,7.37 v10.92,3.81
N$12
  Top 0.254: R4.1 3.56,24.64 4.32,25.4 8.89,25.4 9.27,25.78 U1.7
N$13  (via drill 0.3)
  Top 0.254: R12.1 C12.1 v18.29,33.02 | U2.19 40.78,45.32 v40.64,45.47
  Bottom 0.254: v18.29,33.02 20.83,35.56 27.43,35.56 28.45,34.54 37.59,34.54 39.62,36.58 39.62,44.45 v40.64,45.47
N$15
  Top 0.254: L3.1 C13.1 C18.2 C14.2 | C14.2 18.8,39.12 19.3,39.12 19.56,39.37 19.56,47.5 21.08,49.02 37.34,49.02 38.35,48.01 38.35,45.21 38.78,44.78 U2.21 | C14.2 C17.1
N$16
  Top 0.254: R21.2 9.4,3.05 10.16,3.81 10.16,5.08 10.67,5.59 Q4.3
N$17
  Top 0.254: R21.1 D2/STA.-
N$18
  Top 0.254: R14.2 R16.1 12.89,5.08 Q4.1
N$19
  Top 0.254: L1.1 C19.2 C18.1 C14.1 | C15.2 C14.1 | C14.1 18.8,38.61 19.81,38.61 20.07,38.86 20.07,47.24 21.34,48.51 37.08,48.51 37.85,47.75 37.85,45.21 37.78,45.15 U2.22
N$20  (via drill 0.3)
  Top 0.254: U2.66 39.78,23.21 37.59,25.4 28.7,25.4 27.43,24.13 27.43,22.61 v27.69,22.35 | v14.22,8.38 15.49,8.38 16.26,7.62 R14.1
  Bottom 0.254: v27.69,22.35 27.69,22.86 27.43,23.11 25.15,23.11 24.89,22.86 24.89,21.59 25.65,20.83 25.65,12.95 24.64,11.94 15.24,11.94 14.22,10.92 v14.22,8.38
N$21
  Top 0.406: C11.2 34.54,15.24 34.29,15.49 R10.1 R11.2 33.53,13.46 32.77,12.7 32.77,10.67 32.89,10.54 | ANT1.D 32.89,10.54 | ANT2.5 29.72,6.6 arc90 32.77,9.65 32.77,10.41 arc-90 32.89,10.54
N$23
  Top 0.254: C7.1 57.78,38.73 59.18,40.13 59.18,40.89 59.44,41.15 64.26,41.15 64.77,41.66 64.77,45.97 J13.6
N$29
  Top 0.254: C8.1 57.78,42.55 58.93,43.69 61.98,43.69 J13.5
N$30
  Top 0.254: L4.1 C16.2 R12.2
N$31
  Top 0.254: Q5.1 50.36,14.16 49.02,15.49 R22.1
N$36
  Top 0.406: R3.2 R2.1 Q1.1
N$39
  Top 0.254: C22.1 50.16,11.43 R24.1 R22.2 46.74,13.97 46.48,13.72 D4.2
N$45
  Top 0.254: J2.1 2.8,33.78 4.32,32.26 4.68,32.26 D7.2 5.95,30.99 11.68,30.99 12.45,31.75 L4.2
N$47
  Top 0.254: U1.5 11.81,25.27 12.19,24.89 R5.1 R6.1 C1.2
N$52
  Top 0.406: R11.1 37.85,13.46 arc-90 38.86,12.45 P1.1
PU2
  Top 0.254: D8.- 11,15.62 L2.1 10.54,16.07
  Top 0.406: 10.54,16.07 U1.3
  pour Top (isolate 0.254, no thermals): 9.65,9.14 9.65,19.05 10.16,19.05 10.16,22.1 10.92,22.1 10.92,19.05 11.68,19.05 11.94,19.05 11.94,9.14
PWM1  (via drill 0.3)
  Top 0.254: U2.35 22.99,39.75 23.37,39.37 25.15,39.37 29.72,34.8 29.72,30.48 v30.48,29.72
  Bottom 0.254: J13.1 60.71,32.26 60.71,30.73 56.64,26.67 47.24,26.67 46.48,27.43 45.47,27.43 44.96,27.94 42.67,27.94 40.13,30.48 30.73,30.48 30.48,30.23 v30.48,29.72
PWM2  (via drill 0.3)
  Top 0.254: v29.21,29.72 29.21,34.54 24.89,38.86 23.11,38.86 23,38.75 U2.36
  Bottom 0.254: J13.2 62.99,37.34 61.98,36.32 61.98,34.54 60.96,33.53 60.45,33.53 60.2,33.27 60.2,30.99 56.39,27.18 47.5,27.18 46.74,27.94 45.72,27.94 45.21,28.45 42.93,28.45 40.39,30.99 30.48,30.99 v29.21,29.72
PWRKEY  (via drill 0.3)
  Top 0.254: v26.92,21.59 26.92,24.38 28.45,25.91 37.85,25.91 39.88,23.88 44.45,23.88 44.58,23.75 U2.1 | v14.99,3.3 15.49,2.79 POWER.2
  Top 0.406: U2.1 48.64,23.75 49.02,24.13 Q1.3
  Bottom 0.254: v26.92,21.59 26.92,21.34 26.67,21.08 26.67,12.45 25.15,10.92 15.75,10.92 15.24,10.41 15.24,9.65 15.49,9.4 15.49,7.62 14.99,7.11 v14.99,3.3
RI
  Top 0.254: U2.4 47.58,26.75 48.77,27.94 59.18,27.94 59.94,27.18 59.94,20.57 60.96,19.56 60.96,13.46 61.98,12.45 64.52,12.45 J4.1
SIM_CLK
  Top 0.254: U2.32 27.78,42.32 27.94,42.16 27.94,40.39 28.96,39.37 43.18,39.37 44.7,40.89 50.04,40.89 50.29,40.64 R18.2
SIM_DATA
  Top 0.254: U2.31 28.78,42.5 28.45,42.16 28.45,40.64 29.21,39.88 42.93,39.88 44.45,41.4 50.55,41.4 R19.1
SIM_RST  (via drill 0.3)
  Top 0.254: U2.33 26.78,42.31 27.43,41.66 27.43,40.13 28.7,38.86 43.94,38.86 v44.2,39.12 | v47.5,39.88 R17.2
  Bottom 0.254: v47.5,39.88 46.99,40.39 44.96,40.39 44.2,39.62 v44.2,39.12
SIM_VDD  (via drill 0.3)
  Top 0.254: U2.30 29.78,42.74 28.96,41.91 28.96,40.89 29.46,40.39 42.67,40.39 44.2,41.91 53.09,41.91 v53.59,41.4 53.85,41.15 C20.1 53.85,40.64
  Bottom 0.254: v53.59,41.4 53.59,39.2 SIMHOLDER.1
SPK_P  (via drill 0.3)
  Top 0.254: D5.2 9.14,44.96 8.9,44.71 J2.4 8.89,42.05 8.89,40.64 9.4,40.13 12.45,40.13 12.95,40.64 12.95,42.42 13.46,42.93 L3.2
  Top 0.406: v11.18,42.67 11.18,42.42 10.67,41.91 9.05,41.91 J2.4
  Bottom 0.406: U$4.I1 11.86,43.35 v11.18,42.67
SPKN  (via drill 0.3)
  Top 0.254: D6.2 9.14,32 8.6,32.55 J2.3 8.64,35.19 8.64,37.08 8.89,37.34 12.45,37.34 12.95,36.83 12.95,35.31 13.46,34.8 L1.2
  Top 0.406: v11.94,33.02 10.41,33.02 10.16,32.77 10.16,32.12 D6.2
  Bottom 0.406: U$4.I2 12.47,33.55 v11.94,33.02
SRXD
  Top 0.254: J7.3 51.56,48.26 51.31,48.51 42.67,48.51 41.66,49.53 U3.9
STXD
  Top 0.254: J7.4 51.82,44.96 52.83,45.97 52.83,48.51 52.32,49.02 46.23,49.02 45.72,49.53 U3.8
TRP1
  Top 0.254: D2.+ 52.32,16.76 Q5.3 51.31,16.51 51.82,17.02 R23.1 51.82,19.3 51.56,19.56 48.26,19.56 46.23,17.53 T_5V.T
  pour Top (isolate 0.254): 50.8,15.75 52.58,16 53.09,16 53.59,15.49 55.12,15.49 55.12,17.78 54.61,18.29 51.82,18.29 51.56,18.03 51.56,17.27 50.8,16.51
VBAT  (via drill 0.3)
  Top 0.254: L2.2 16.44,15.88 C3.+ C4.2 24.51,15.75 C9.2 C5.2 29.46,15.75 29.97,16.26 29.97,19.75 U2.56 | 15.75,16.57 L2.2 | D3/NET.+ D2/STA.+ 5.84,3.56 6.35,4.06 8.13,4.06 8.64,3.56 9.14,3.56 9.65,4.06 9.65,7.37 8.89,8.13 v8.89,9.14 | L2.2 16.31,13.77 v16.26,13.72 16.51,13.72 17.27,12.95 17.27,8.13 17.78,7.62 17.78,7.37 PWR.+
  Top 0.406: 15.75,16.57 C1.1 R6.2 17.02,23.11 17.27,22.86 v17.27,22.61
  Bottom 0.254: v8.89,9.14 10.67,9.14 11.18,8.64 12.45,8.64 13.21,9.4 13.21,11.43 14.73,12.95 16,12.95 16.26,13.21 v16.26,13.72
  Bottom 0.406: T_4.1V.T v17.27,22.61
  pour Top (no thermals): 14.22,14.22 22.1,14.22 23.11,15.24 30.23,15.24 31.24,16.26 31.24,19.3 30.73,19.81 28.7,19.81 28.19,19.3 28.19,17.53 27.69,17.02 22.86,17.02 21.84,18.03 15.24,18.03 14.22,17.78
VDD_EXT  (via drill 0.3)
  Top 0.254: R8.6 56.26,34.16 56.13,34.04 56.13,33.53 56.33,33.34 R8.5 56.9,32.51 | Q6.1 48.58,32.19 48.77,32 v49.28,32 51.82,32 | U2.15 47.34,37.75 47.75,37.34 47.75,35.31 v48.01,35.05 | v54.86,32 55.37,32.51 56.9,32.51 | 51.82,32 v52.58,32 | Q7.1 51.88,32.07 51.82,32 | 56.9,32.51 56.9,30.99 57.4,30.48 60.45,30.48 60.96,29.97 v61.47,29.97
  Bottom 0.254: v61.47,29.97 61.72,29.72 61.72,24.64 62.74,23.62 64.01,23.62 64.77,22.86 64.77,17.78 J4.7 | v48.01,35.05 49.28,33.78 v49.28,32 | v52.58,32 v54.86,32
VIN  (via drill 0.3)
  Top 0.254: 9.27,20.45 8.64,19.81 C24.2
  Top 0.406: R4.2 C24.2 | U1.2 9.27,20.45
  Top 2.032: D1.- D2.- 59.36,18.62 56.9,21.08 v46.48,21.08 | v5.33,13.72 C2.+
  Bottom 0.254: v46.48,21.08 45.97,21.08
  Bottom 0.406: T_EXT.T 18.8,24.64
  Bottom 2.032: 45.97,21.08 42.42,24.64 18.8,24.64 7.62,24.64 arc90 5.33,22.35 v5.33,13.72
  pour Top (isolate 0.254, no thermals): 4.32,12.7 4.32,20.32 8.64,20.32 8.64,22.35 9.65,22.35 9.65,19.56 6.35,19.56 6.35,12.7
VRTC  (via drill 0.3)
  Top 0.254: U2.26 33.78,46.86 C6.2
  Top 1.016: C6.2 v32,46.99
  Bottom 1.016: v32,46.99 31.24,46.99 29.21,44.96 24.71,44.96 J1.+

### Text on the board
Bottom: RRR
tPlace: SIM900 | PIN1
tNames: RGPR0900 | Diseño / Ensamble | en México | SwSerial | cuantex.com
bNames: RGPR0900 | Diseño / Ensamle | en México | www.cuantex.com